# EAGLE design programmer (EAGLE 9.4.2)
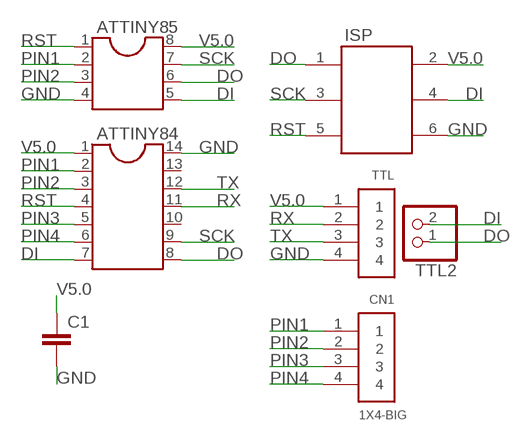
[diagram p0: schematic, sheet 1]

## Parts
ATTINY84  DIL14S  [SOCKET-14]
ATTINY85  DIL8S  [SOCKET-08]
C1  C-EU025-025X050  [C025-025X050]
CN1  1X4-BIG  [1X04-BIG]
ISP  61200621621  [61200621621]
TTL  1X4-BIG  [1X04-BIG]
TTL2  PINHD-1X2  [1X02]

## Nets
DI: ATTINY84.7 ATTINY85.5 ISP.4 TTL2.2
DO: ATTINY84.8 ATTINY85.6 ISP.1 TTL2.1
GND: ATTINY84.14 ATTINY85.4 C1.2 ISP.6 TTL.4
PIN1: ATTINY84.2 ATTINY85.2 CN1.1
PIN2: ATTINY84.3 ATTINY85.3 CN1.2
PIN3: ATTINY84.5 CN1.3
PIN4: ATTINY84.6 CN1.4
RST: ATTINY84.4 ATTINY85.1 ISP.5
RX: ATTINY84.11 TTL.2
SCK: ATTINY84.9 ATTINY85.7 ISP.3
TX: ATTINY84.12 TTL.3
V5.0: ATTINY84.1 ATTINY85.8 C1.1 ISP.2 TTL.1
Unconnected: ATTINY84.10 ATTINY84.13

## Library data of the parts
ATTINY84 = ic-package:DIL14: Dual In Line / Socket
ATTINY85 = ic-package:DIL8: Dual In Line / Socket
C1 = rcl:C-EU: CAPACITOR, European symbol; SPICEPREFIX: C
CN1 TTL = adafruit:1X4: 4-pin connector
ISP = Wurth_Elektronik_Electromechanic_Wire_to_Board_Connectors_rev18a:61200621621: WR-BHD 2.54mm Male Box Header, 6 Pins=>Code : Con_WTB_BHD_2.54_Male_THT_WS_61200621621 <http://katalog.we-online.de/media/thumbs2/eican/thb_Con_WTB_BHD_2.54_Male_THT_WS_6120xx21621_pf2.jpg> Details see: http://katalog.we-online.de/en/em/612_0xx_216_21 Created 2014-06-04, Karrer Zheng 2014 (C) Würth Elektronik
TTL2 = pinhead:PINHD-1X2: PIN HEADER

## Net classes
0 default: width 0.254 mm

## Board
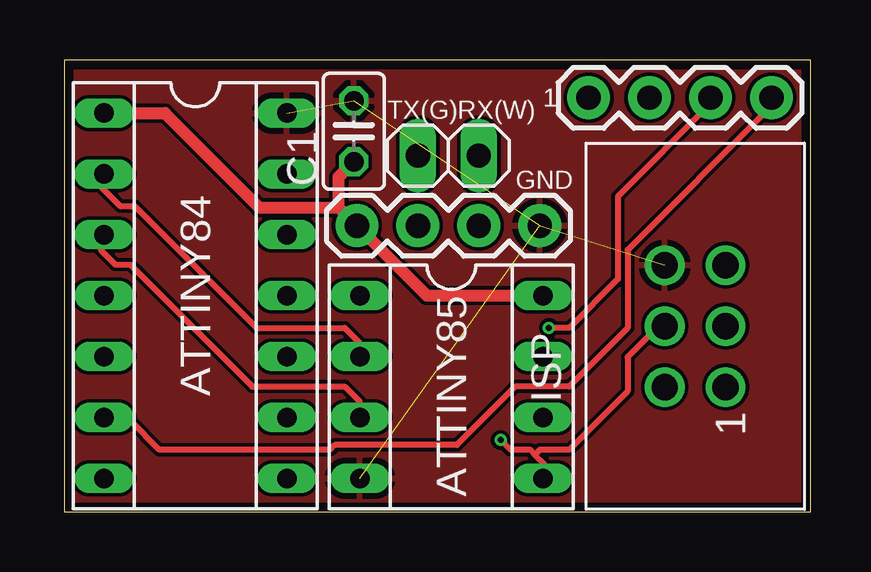
[diagram p1: board, top side]
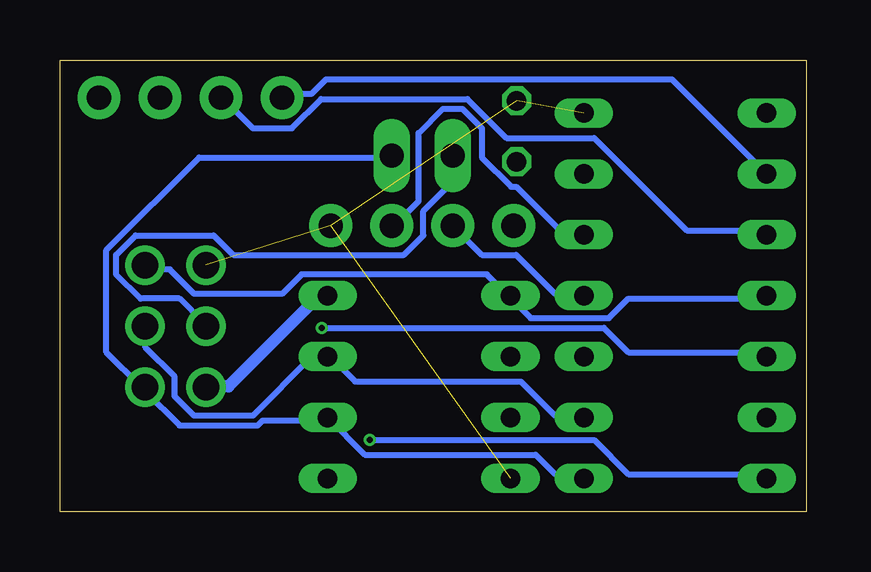
[diagram p2: board, bottom side, seen from below]

Size 31.1 x 18.85 mm. Coordinates in mm from the lower left corner, seen from the top.
Outline: 31.1,18.85 0,18.85 0,0 31.1,0 31.1,18.85
Copper layers (1*16): Top 0.035559375mm / dielectric 1.6mm / Bottom 0.035559375mm
Design rules "oshpark-2layer": minimum track width 6mil, minimum drill 10mil, track to track 6mil, track to pad 6mil, pad to pad 6mil, via to via 6mil, smd to smd 6mil, copper to edge 15mil, drill to drill 6mil, minimum pad ring 5mil, minimum via ring 5mil, stop-mask expansion 2.5mil, vias tented up to drill 0mil, thermal gap 10mil

### Footprints (pad centres in the part's own frame; a part is rotated, then mirrored left to right if it is on the bottom)
SOCKET-14 = drill 0.813 long: 1 -7.62,-3.81; 2 -5.08,-3.81; 3 -2.54,-3.81; 4 0,-3.81; 5 2.54,-3.81; 6 5.08,-3.81; 7 7.62,-3.81; 8 7.62,3.81; 9 5.08,3.81; 10 2.54,3.81; 11 0,3.81; 12 -2.54,3.81; 13 -5.08,3.81; 14 -7.62,3.81
SOCKET-08 = drill 0.813 long: 1 -3.81,-3.81; 2 -1.27,-3.81; 3 1.27,-3.81; 4 3.81,-3.81; 5 3.81,3.81; 6 1.27,3.81; 7 -1.27,3.81; 8 -3.81,3.81
C025-025X050 = drill 0.813 octagon: 1 -1.27,0; 2 1.27,0
1X04-BIG = drill 1.016 pad 1.778: 1 0,0; 2 2.54,0; 3 5.08,0; 4 7.62,0
61200621621 = drill 1.1: 1 -2.54,-1.27; 2 -2.54,1.27; 3 0,-1.27; 4 0,1.27; 5 2.54,-1.27; 6 2.54,1.27
1X02 = drill 1.016 long: 1 -1.27,0; 2 1.27,0

### Placement (x,y rotation side)
ATTINY84  5.46,9.02 270 top
ATTINY85  16.13,5.21 270 top
C1  12.07,15.88 90 top
CN1  21.84,17.27 0 top
ISP  26.29,7.75 90 top
TTL  12.19,11.94 0 top
TTL2  16,14.86 180 top

### Tracks (layer width: path | path; a pad name or v marks a point on that pad's centre or on a via)
DI  (via drill 0.25)
  Top 0.254: v18.19,3 18.59,2.59 19.41,2.59 19.61,2.39 | 19.61,2.39 20.02,1.98 20.02,1.58 ATTINY85.5 | 19.61,2.39 19.81,2.59 21.03,2.59 23.47,5.03 23.47,6.45 24.89,7.87 ISP.4
  Bottom 0.254: v18.19,3 8.84,3 7.42,1.58 1.73,1.58 ATTINY84.7 | TTL2.2 14.73,13.77 15.95,12.55 15.95,11.53 16.76,10.72 23.88,10.72 24.69,11.53 27.94,11.53 28.75,10.72 28.75,9.91 27.74,8.89 26.11,8.89 25.1,7.87 ISP.4
DO
  Bottom 0.254: ATTINY84.8 9.45,1.58 10.46,1.58 11.28,2.39 18.39,2.39 ATTINY85.6 20.02,3.81 22.66,3.81 22.86,3.61 26.11,3.61 27.53,5.03 ISP.1 27.74,5.23 29.16,6.65 29.16,10.92 25.3,14.78 17.37,14.78 TTL2.1
GND  (4 unrouted)
  pour Top: 0.51,20.32 -0.76,20.32 -0.76,-1.27 32.26,-1.27 32.26,20.32
PIN1
  Top 0.254: ATTINY85.2 12.29,6.65 12.29,7.06 11.68,7.67 8.03,7.67 2.95,12.75 2.34,12.75 1.52,13.56 1.52,13.97 ATTINY84.2
  Bottom 0.254: ATTINY84.2 5.59,18.03 20.02,18.03 20.62,17.42 21.84,17.42 CN1.1
PIN2
  Top 0.254: ATTINY85.3 12.29,4.01 12.29,4.62 11.68,5.23 7.82,5.23 2.74,10.31 2.13,10.31 1.52,10.92 1.52,11.53 ATTINY84.3
  Bottom 0.254: ATTINY84.3 1.73,11.74 4.98,11.74 8.84,15.6 12.5,15.6 14.12,17.22 20.22,17.22 21.44,16 23.06,16 24.28,17.22 CN1.2
PIN3  (via drill 0.25)
  Top 0.254: v20.19,7.67 21.03,7.67 23.06,9.7 23.06,13.16 26.92,17.02 CN1.3
  Bottom 0.254: v20.19,7.67 8.43,7.67 7.42,6.65 1.73,6.65 ATTINY84.5
PIN4
  Top 0.254: ATTINY84.6 1.73,3.81 2.74,3.81 3.96,2.59 11.07,2.59 11.28,2.79 16.36,2.79 18.8,5.23 21.03,5.23 23.47,7.67 23.47,10.92 29.36,16.82 29.36,17.22 CN1.4
RST
  Bottom 0.254: ATTINY84.4 1.73,8.89 7.42,8.89 8.23,8.08 11.48,8.08 12.29,8.89 ATTINY85.1 12.5,9.09 13.31,9.91 21.03,9.91 21.84,9.09 25.5,9.09 26.52,10.11 27.53,10.11 ISP.5
RX
  Bottom 0.254: TTL.2 13.51,10.72 12.09,10.72 10.46,9.09 9.45,9.09 ATTINY84.11
SCK
  Bottom 0.254: ATTINY84.9 9.45,4.01 10.46,4.01 11.89,5.44 18.8,5.44 19.81,6.45 ATTINY85.7 20.02,6.45 20.62,6.45 23.06,4.01 25.5,4.01 26.31,4.83 26.31,5.64 27.53,6.86 27.53,7.67 ISP.3
TX
  Bottom 0.254: ATTINY84.12 9.45,11.74 10.26,11.74 12.09,13.56 12.29,13.56 13.51,14.78 13.51,16 14.33,16.82 15.14,16.82 16.15,15.8 16.15,12.95 17.17,11.94 TTL.3
V5.0
  Top 0.508: ATTINY84.1 4.19,16.64 8.13,12.7 11.43,12.7 | 11.43,12.7 TTL.1 15.11,9.02 ATTINY85.8 | 11.43,12.7 11.43,13.97 C1.1
  Bottom 0.254: 24.89,5.23 ISP.2 | 20.02,8.89 ATTINY85.8
  Bottom 0.508: 24.89,5.23 24.08,5.23 20.42,8.89 20.02,8.89

### Text on the board
tNames: TX(G) | RX(W) | 1 | GND